# EAGLE design MIDI Servo Controller (EAGLE 9.5.0)
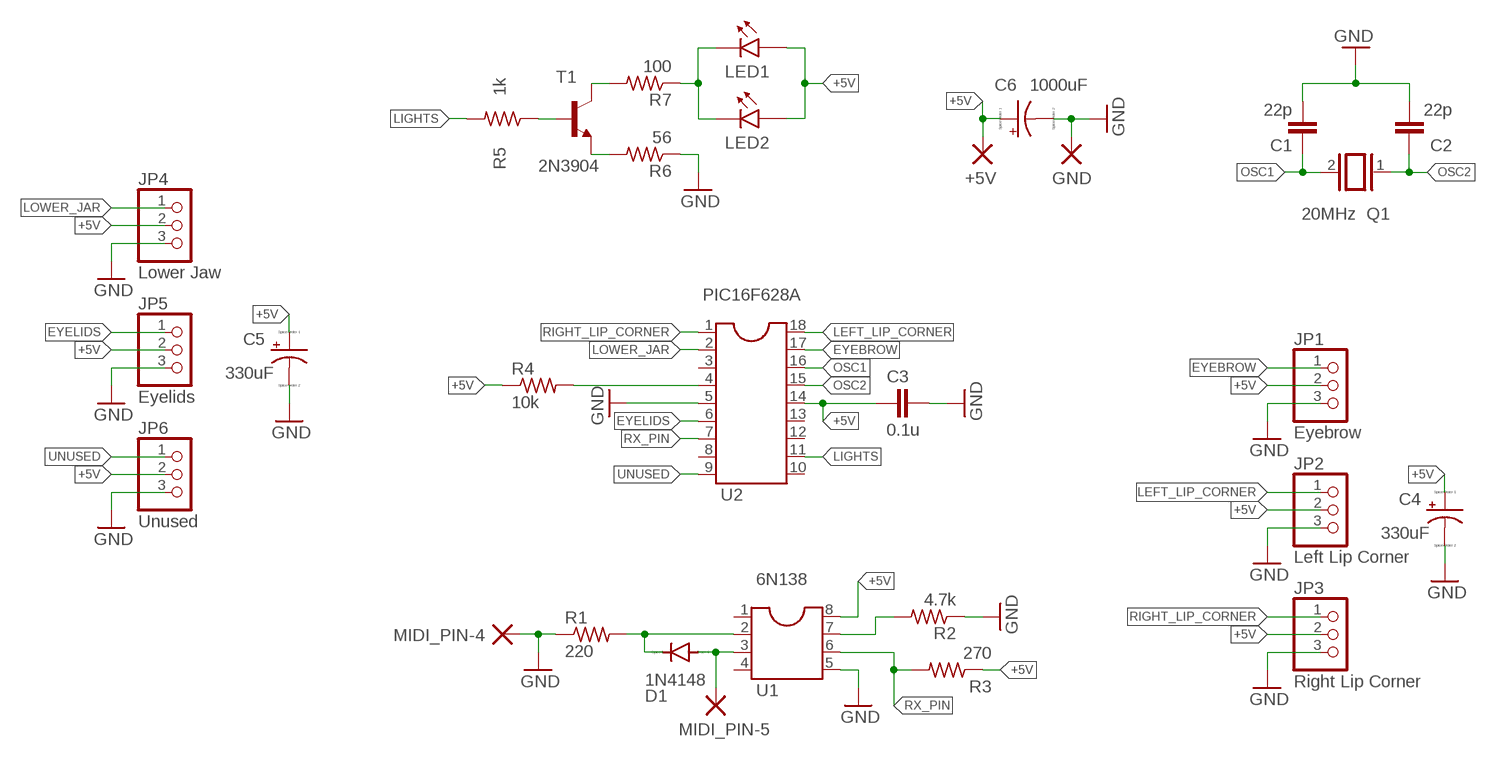
[diagram p0: schematic, sheet 1]

## Parts
6N138  U1  DIL8S  [SOCKET-08]
+5V  DOUBLE_THROUGH_HOLE_PAD  [DOUBLE_THROUGH_HOLE_PAD]
C1  22p  C-EU050-025X075  [C050-025X075]
C2  22p  C-EU050-025X075  [C050-025X075]
C3  0.1u  C-EU050-025X075  [C050-025X075]
C4  330uF  CPOL-USE3.5-8  [E3,5-8]
C5  330uF  CPOL-USE3.5-8  [E3,5-8]
C6  1000uF  CPOL-USE5-10.5  [E5-10,5]
D1  1N4148  1N4148DO35-10  [DO35-10]
GND  DOUBLE_THROUGH_HOLE_PAD  [DOUBLE_THROUGH_HOLE_PAD]
JP1  Eyebrow  PINHD-1X3  [1X03]
JP2  Left Lip Corner  PINHD-1X3  [1X03]
JP3  Right Lip Corner  PINHD-1X3  [1X03]
JP4  Lower Jaw  PINHD-1X3  [1X03]
JP5  Eyelids  PINHD-1X3  [1X03]
JP6  Unused  PINHD-1X3  [1X03]
LED1  REMOTE_LED  [REMOTE_LED]
LED2  REMOTE_LED  [REMOTE_LED]
MIDI_PIN-4  DOUBLE_THROUGH_HOLE_PAD  [DOUBLE_THROUGH_HOLE_PAD]
MIDI_PIN-5  DOUBLE_THROUGH_HOLE_PAD  [DOUBLE_THROUGH_HOLE_PAD]
PIC16F628A  U2  DIL18S  [SOCKET-18]
Q1  20MHz  XTAL/S  [QS]
R1  220  R-US_0207/12  [0207/12]
R2  4.7k  R-US_0207/12  [0207/12]
R3  270  R-US_0207/12  [0207/12]
R4  10k  R-US_0207/12  [0207/12]
R5  1k  R-US_0207/12  [0207/12]
R6  56  R-US_0207/12  [0207/12]
R7  100  R-US_0207/12  [0207/12]
T1  2N3904  [TO92]

## Nets
+5V: 6N138.8 +5V.P$1 C3.2 C4.+ C5.+ C6.+ JP1.2 JP2.2 JP3.2 JP4.2 JP5.2 JP6.2 LED1.P$1 LED2.P$1 PIC16F628A.14 R3.1 R4.1
EYEBROW: JP1.1 PIC16F628A.17
EYELIDS: JP5.1 PIC16F628A.6
GND: 6N138.5 C1.2 C2.2 C3.1 C4.- C5.- C6.- GND.P$1 JP1.3 JP2.3 JP3.3 JP4.3 JP5.3 JP6.3 MIDI_PIN-4.P$1 PIC16F628A.5 R1.1 R2.1 R6.1
LEFT_LIP_CORNER: JP2.1 PIC16F628A.18
LIGHTS: PIC16F628A.11 R5.2
LOWER_JAR: JP4.1 PIC16F628A.2
MIDI_PIN-5: 6N138.3 D1.A MIDI_PIN-5.P$1
N$1: 6N138.2 D1.C R1.2
N$2: 6N138.7 R2.2
N$5: R5.1 T1.2(B)
N$6: PIC16F628A.4 R4.2
N$7: R6.2 T1.3(E)
N$9: R7.2 T1.1(C)
N$10: LED1.P$2 LED2.P$2 R7.1
OSC1: C1.1 PIC16F628A.16 Q1.2
OSC2: C2.1 PIC16F628A.15 Q1.1
RIGHT_LIP_CORNER: JP3.1 PIC16F628A.1
RX_PIN: 6N138.6 PIC16F628A.7 R3.2
UNUSED: JP6.1 PIC16F628A.9
Unconnected: 6N138.1 6N138.4 PIC16F628A.3 PIC16F628A.8 PIC16F628A.10 PIC16F628A.12 PIC16F628A.13

## Library data of the parts
6N138 = ic-package:DIL8: Dual In Line / Socket
+5V GND MIDI_PIN-4 MIDI_PIN-5 = Double-Through-Hole-Pad:DOUBLE_THROUGH_HOLE_PAD
C1-C3 = resistor:C-EU: CAPACITOR, European symbol
C4-C6 = resistor:CPOL-US: POLARIZED CAPACITOR, American symbol
D1 = diode:1N4148: DIODE high speed (Philips)
JP1-JP6 = adafruit:PINHD-1X3: PIN HEADER
LED1 LED2 = Remote-LED:REMOTE_LED
PIC16F628A = ic-package:DIL18: Dual In Line / Socket
Q1 = special:XTAL/S: CRYSTAL
R1-R7 = resistor:R-US_: RESISTOR, American symbol
T1 = transistor:2N3904: NPN TRANSISTOR

## Board
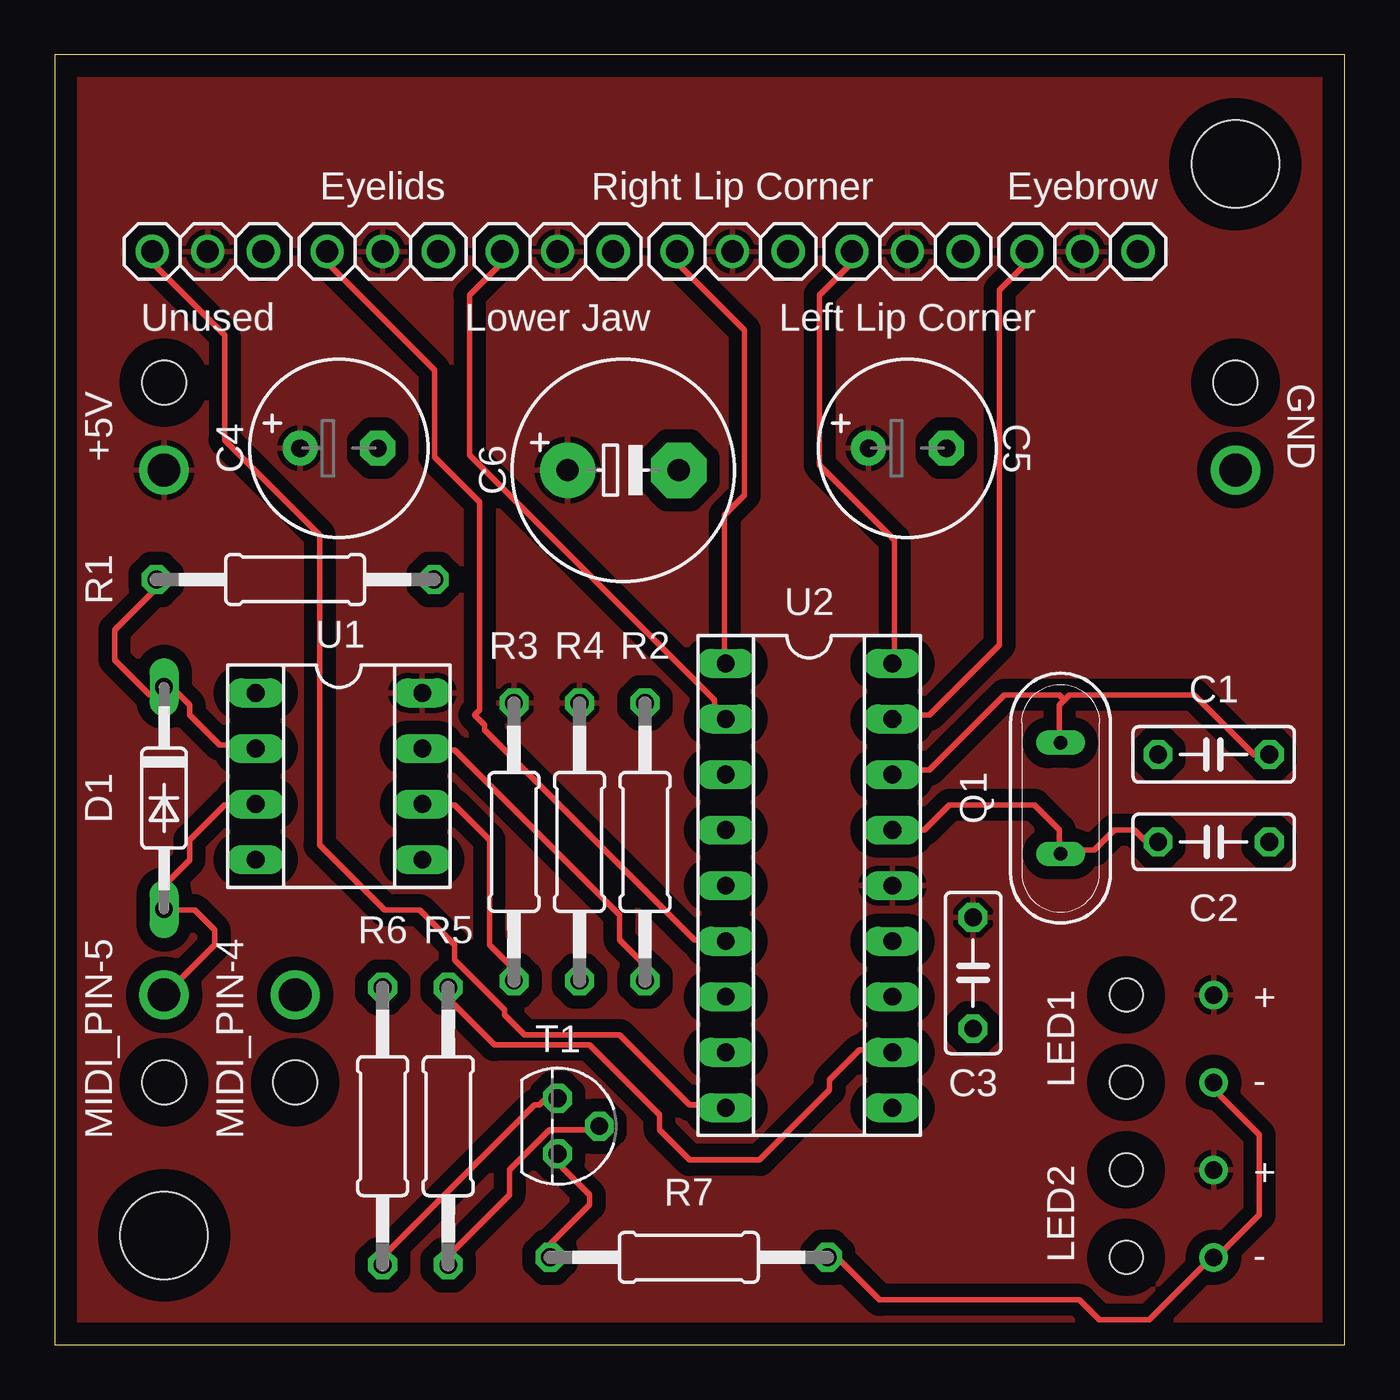
[diagram p1: board, top side]
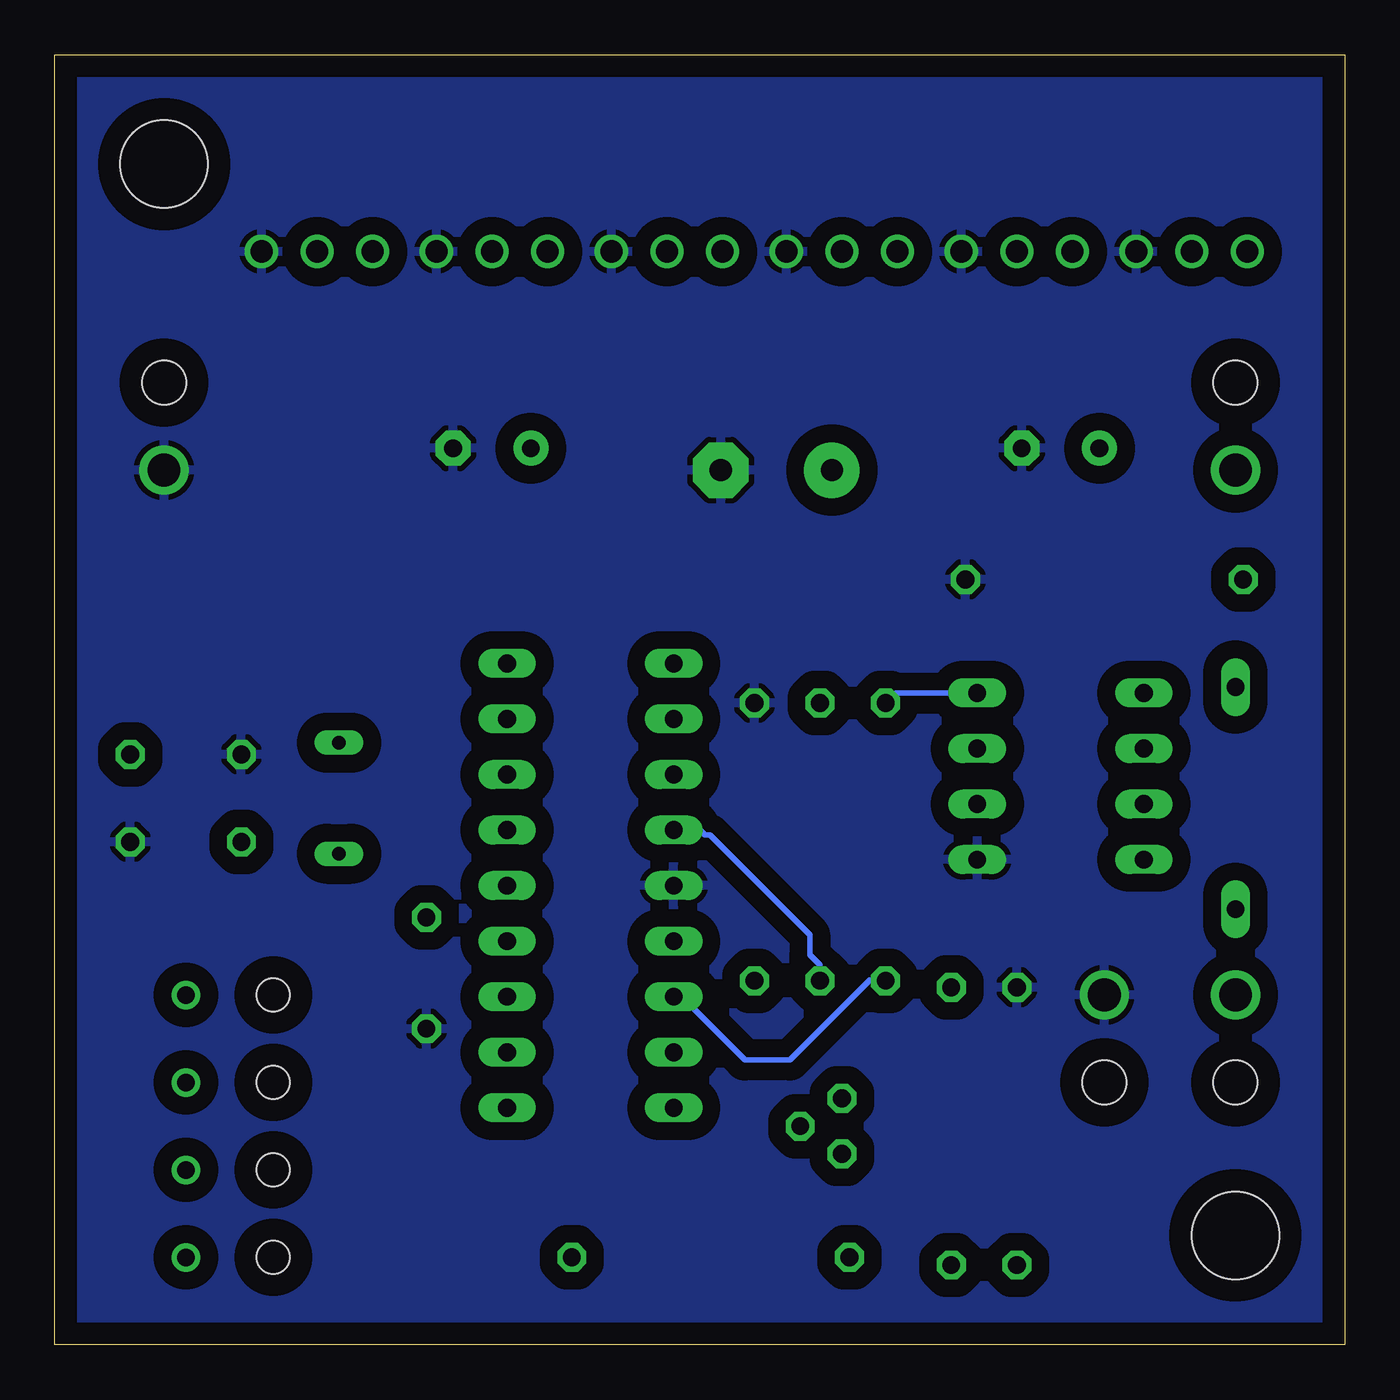
[diagram p2: board, bottom side, seen from below]

Size 59 x 59 mm. Coordinates in mm from the lower left corner, seen from the top.
Outline: 0,0 59,0 59,59 0,59 0,0
Copper layers (1*16): Top 0.035mm / dielectric 1.5mm / Bottom 0.035mm
Design rules "default": minimum track width 10mil, minimum drill 24mil, track to track 8mil, track to pad 8mil, pad to pad 8mil, via to via 8mil, smd to smd 8mil, copper to edge 40mil, drill to drill 8mil, minimum pad ring 10mil, minimum via ring 8mil, stop-mask expansion 4mil, vias tented up to drill 0mil, thermal gap 10mil
Holes 4 mm at 5,5 54,54

### Footprints (pad centres in the part's own frame; a part is rotated, then mirrored left to right if it is on the bottom)
SOCKET-08 = drill 0.813 long: 1 -3.81,-3.81; 2 -1.27,-3.81; 3 1.27,-3.81; 4 3.81,-3.81; 5 3.81,3.81; 6 1.27,3.81; 7 -1.27,3.81; 8 -3.81,3.81
DOUBLE_THROUGH_HOLE_PAD = drill 1.5: P$1 -2,0 | hole 2: 2,0
C050-025X075 = drill 0.813 octagon: 1 -2.54,0; 2 2.54,0
E3,5-8 = drill 0.813 pad 1.6: + -1.778,0 | drill 0.813 pad 1.6 octagon: - 1.778,0
E5-10,5 = drill 1.016 pad 2.54: + -2.54,0 | drill 1.016 pad 2.54 octagon: - 2.54,0
DO35-10 = drill 0.813 long: A 5.08,0; C -5.08,0
1X03 = drill 1.016: 1 -2.54,0; 2 0,0; 3 2.54,0
REMOTE_LED = drill 0.8: P$1 2,2; P$2 2,-2 | hole 1.5: -2,2; -2,-2
SOCKET-18 = drill 0.813 long: 1 -10.16,-3.81; 2 -7.62,-3.81; 3 -5.08,-3.81; 4 -2.54,-3.81; 5 0,-3.81; 6 2.54,-3.81; 7 5.08,-3.81; 8 7.62,-3.81; 9 10.16,-3.81; 10 10.16,3.81; 11 7.62,3.81; 12 5.08,3.81; 13 2.54,3.81; 14 0,3.81; 15 -2.54,3.81; 16 -5.08,3.81; 17 -7.62,3.81; 18 -10.16,3.81
QS = drill 0.61 long: 1 -2.54,0; 2 2.54,0
0207/12 = drill 0.813 octagon: 1 -6.35,0; 2 6.35,0
TO92 = drill 0.813 octagon: 1 1.27,0; 2 0,1.905; 3 -1.27,0

### Placement (x,y rotation side)
6N138  13,26 270 top
+5V  5,42 90 top
C1  53,27 180 top
C2  53,23 0 top
C3  42,17 90 top
C4  13,41 0 top
C5  39,41 0 top
C6  26,40 0 top
D1  5,25 270 top
GND  54,42 90 top
JP1  47,50 0 top
JP2  39,50 0 top
JP3  31,50 0 top
JP4  23,50 0 top
JP5  15,50 0 top
JP6  7,50 0 top
LED1  51,14 0 top
LED2  51,6 0 top
MIDI_PIN-4  11,14 270 top
MIDI_PIN-5  5,14 270 top
PIC16F628A  34.5,21 270 top
Q1  46,25 90 top
R1  11,35 180 top
R2  27,23 270 top
R3  21,23 270 top
R4  24,23 270 top
R5  18,10 90 top
R6  15,10 270 top
R7  29,4 180 top
T1  23,10 270 top

### Tracks (layer width: path | path; a pad name or v marks a point on that pad's centre or on a via)
+5V
  Bottom 0.254: R3.1 20.54,29.81 6N138.8
  pour Top (isolate 0.61): 0,0 0,59 59,59 59,0
EYEBROW
  Top 0.254: PIC16F628A.17 38.41,28.8 40.01,28.8 43.2,32 43.2,48.23 44.35,49.38 44.35,49.84 JP1.1
EYELIDS
  Top 0.254: PIC16F628A.6 30.63,18.52 29.26,18.52 19.66,28.12 19.66,28.35 19.2,28.8 19.43,29.03 19.43,38.55 17.37,40.6 17.37,44.58 12.57,49.38 12.57,49.84 JP5.1
GND
  pour Bottom (isolate 0.813): 0,59 0,0 59,0 59,59
LEFT_LIP_CORNER
  Top 0.254: PIC16F628A.18 38.41,31.32 38.41,36.8 34.98,40.23 34.98,48.01 36.35,49.38 36.35,49.84 JP2.1
LIGHTS
  Top 0.254: R5.2 18.06,16.23 18.06,15.77 20.12,13.72 24.46,13.72 27.66,10.52 27.66,9.83 29.03,8.46 32.23,8.46 35.43,11.66 35.43,12.12 36.8,13.49 38.18,13.49 PIC16F628A.11
LOWER_JAR
  Top 0.254: PIC16F628A.2 30.63,28.8 30.18,29.26 30.18,29.49 18.97,40.69 18.97,48.01 20.34,49.38 20.34,49.84 JP4.1
MIDI_PIN-5
  Top 0.254: MIDI_PIN-5.P$1 5.03,16 7.32,18.29 7.32,18.97 6.4,19.89 5.03,19.89 D1.A 5.03,20.12 5.03,21.03 6.17,22.17 6.17,23.09 7.77,24.69 9.14,24.69 6N138.3
N$1
  Top 0.254: 6N138.2 9.14,27.43 7.54,27.43 6.17,28.8 6.17,29.26 5.49,29.95 5.03,29.95 D1.C 4.8,29.95 4.57,29.72 4.34,29.72 2.74,31.32 2.74,32.69 4.57,34.52 4.57,34.98 R1.2
N$2
  Top 0.254: 6N138.7 16.92,27.2 18.29,27.2 25.83,19.66 25.83,18.52 26.98,17.37 26.98,16.69 R2.2
N$5
  Top 0.254: R5.1 18.06,3.66 18.06,4.12 20.8,6.86 20.8,8 22.63,9.83 24.69,9.83 T1.2
N$6
  Bottom 0.254: R4.2 24,16.69 24,17.37 24.46,17.83 24.46,18.75 29.03,23.32 29.26,23.32 29.49,23.55 30.63,23.55 PIC16F628A.4
N$7
  Top 0.254: R6.2 15.09,3.66 15.09,4.12 21.95,10.97 22.17,10.97 22.4,11.2 22.86,11.2 T1.3
N$9
  Top 0.254: R7.2 22.63,4.12 22.63,4.57 24.46,6.4 24.46,6.86 23.09,8.23 23.09,8.69 T1.1
N$10
  Top 0.254: LED1.P$2 52.81,11.89 55.09,9.6 55.09,5.94 53.26,4.12 53.03,4.12 LED2.P$2 52.81,4.12 52.58,3.89 52.58,3.66 50.06,1.14 47.78,1.14 46.86,2.06 37.72,2.06 35.89,3.89 35.43,3.89 R7.1
OSC1
  Top 0.254: 46.18,29.49 46.41,29.72 52.12,29.72 54.86,26.98 55.32,26.98 C1.1 | 46.18,29.49 45.95,29.26 45.95,27.66 Q1.2 | 46.18,29.49 45.95,29.72 43.43,29.72 40.01,26.29 38.41,26.29 PIC16F628A.16
OSC2
  Top 0.254: C2.1 50.29,23.09 49.84,23.09 49.38,23.55 48.46,23.55 47.55,22.63 46.18,22.63 Q1.1 45.95,22.63 45.95,23.55 44.81,24.69 40.92,24.69 39.78,23.55 38.41,23.55 PIC16F628A.15
RIGHT_LIP_CORNER
  Top 0.254: PIC16F628A.1 30.63,31.32 30.63,37.95 31.55,38.86 31.55,46.41 28.57,49.38 28.57,49.84 JP3.1
RX_PIN
  Top 0.254: 6N138.6 16.92,24.69 18.29,24.69 19.89,23.09 19.89,18.29 20.8,17.37 20.8,16.69 R3.2
  Bottom 0.254: PIC16F628A.7 30.63,15.77 30.18,15.77 27.43,13.03 25.38,13.03 21.72,16.69 21.03,16.69 R3.2
UNUSED
  Top 0.254: PIC16F628A.9 30.63,10.97 29.03,10.97 25.83,14.17 21.49,14.17 20.57,15.09 20.57,15.32 18.29,17.6 18.29,18.29 16.69,19.89 15.09,19.89 12.12,22.86 12.12,37.03 7.77,41.38 7.77,46.18 4.57,49.38 4.57,49.84 JP6.1